# EasyEDA Pro project ProPrj_New Project_2025-07-06_18-28-47_2025-07-14.epro

# Board PCB1
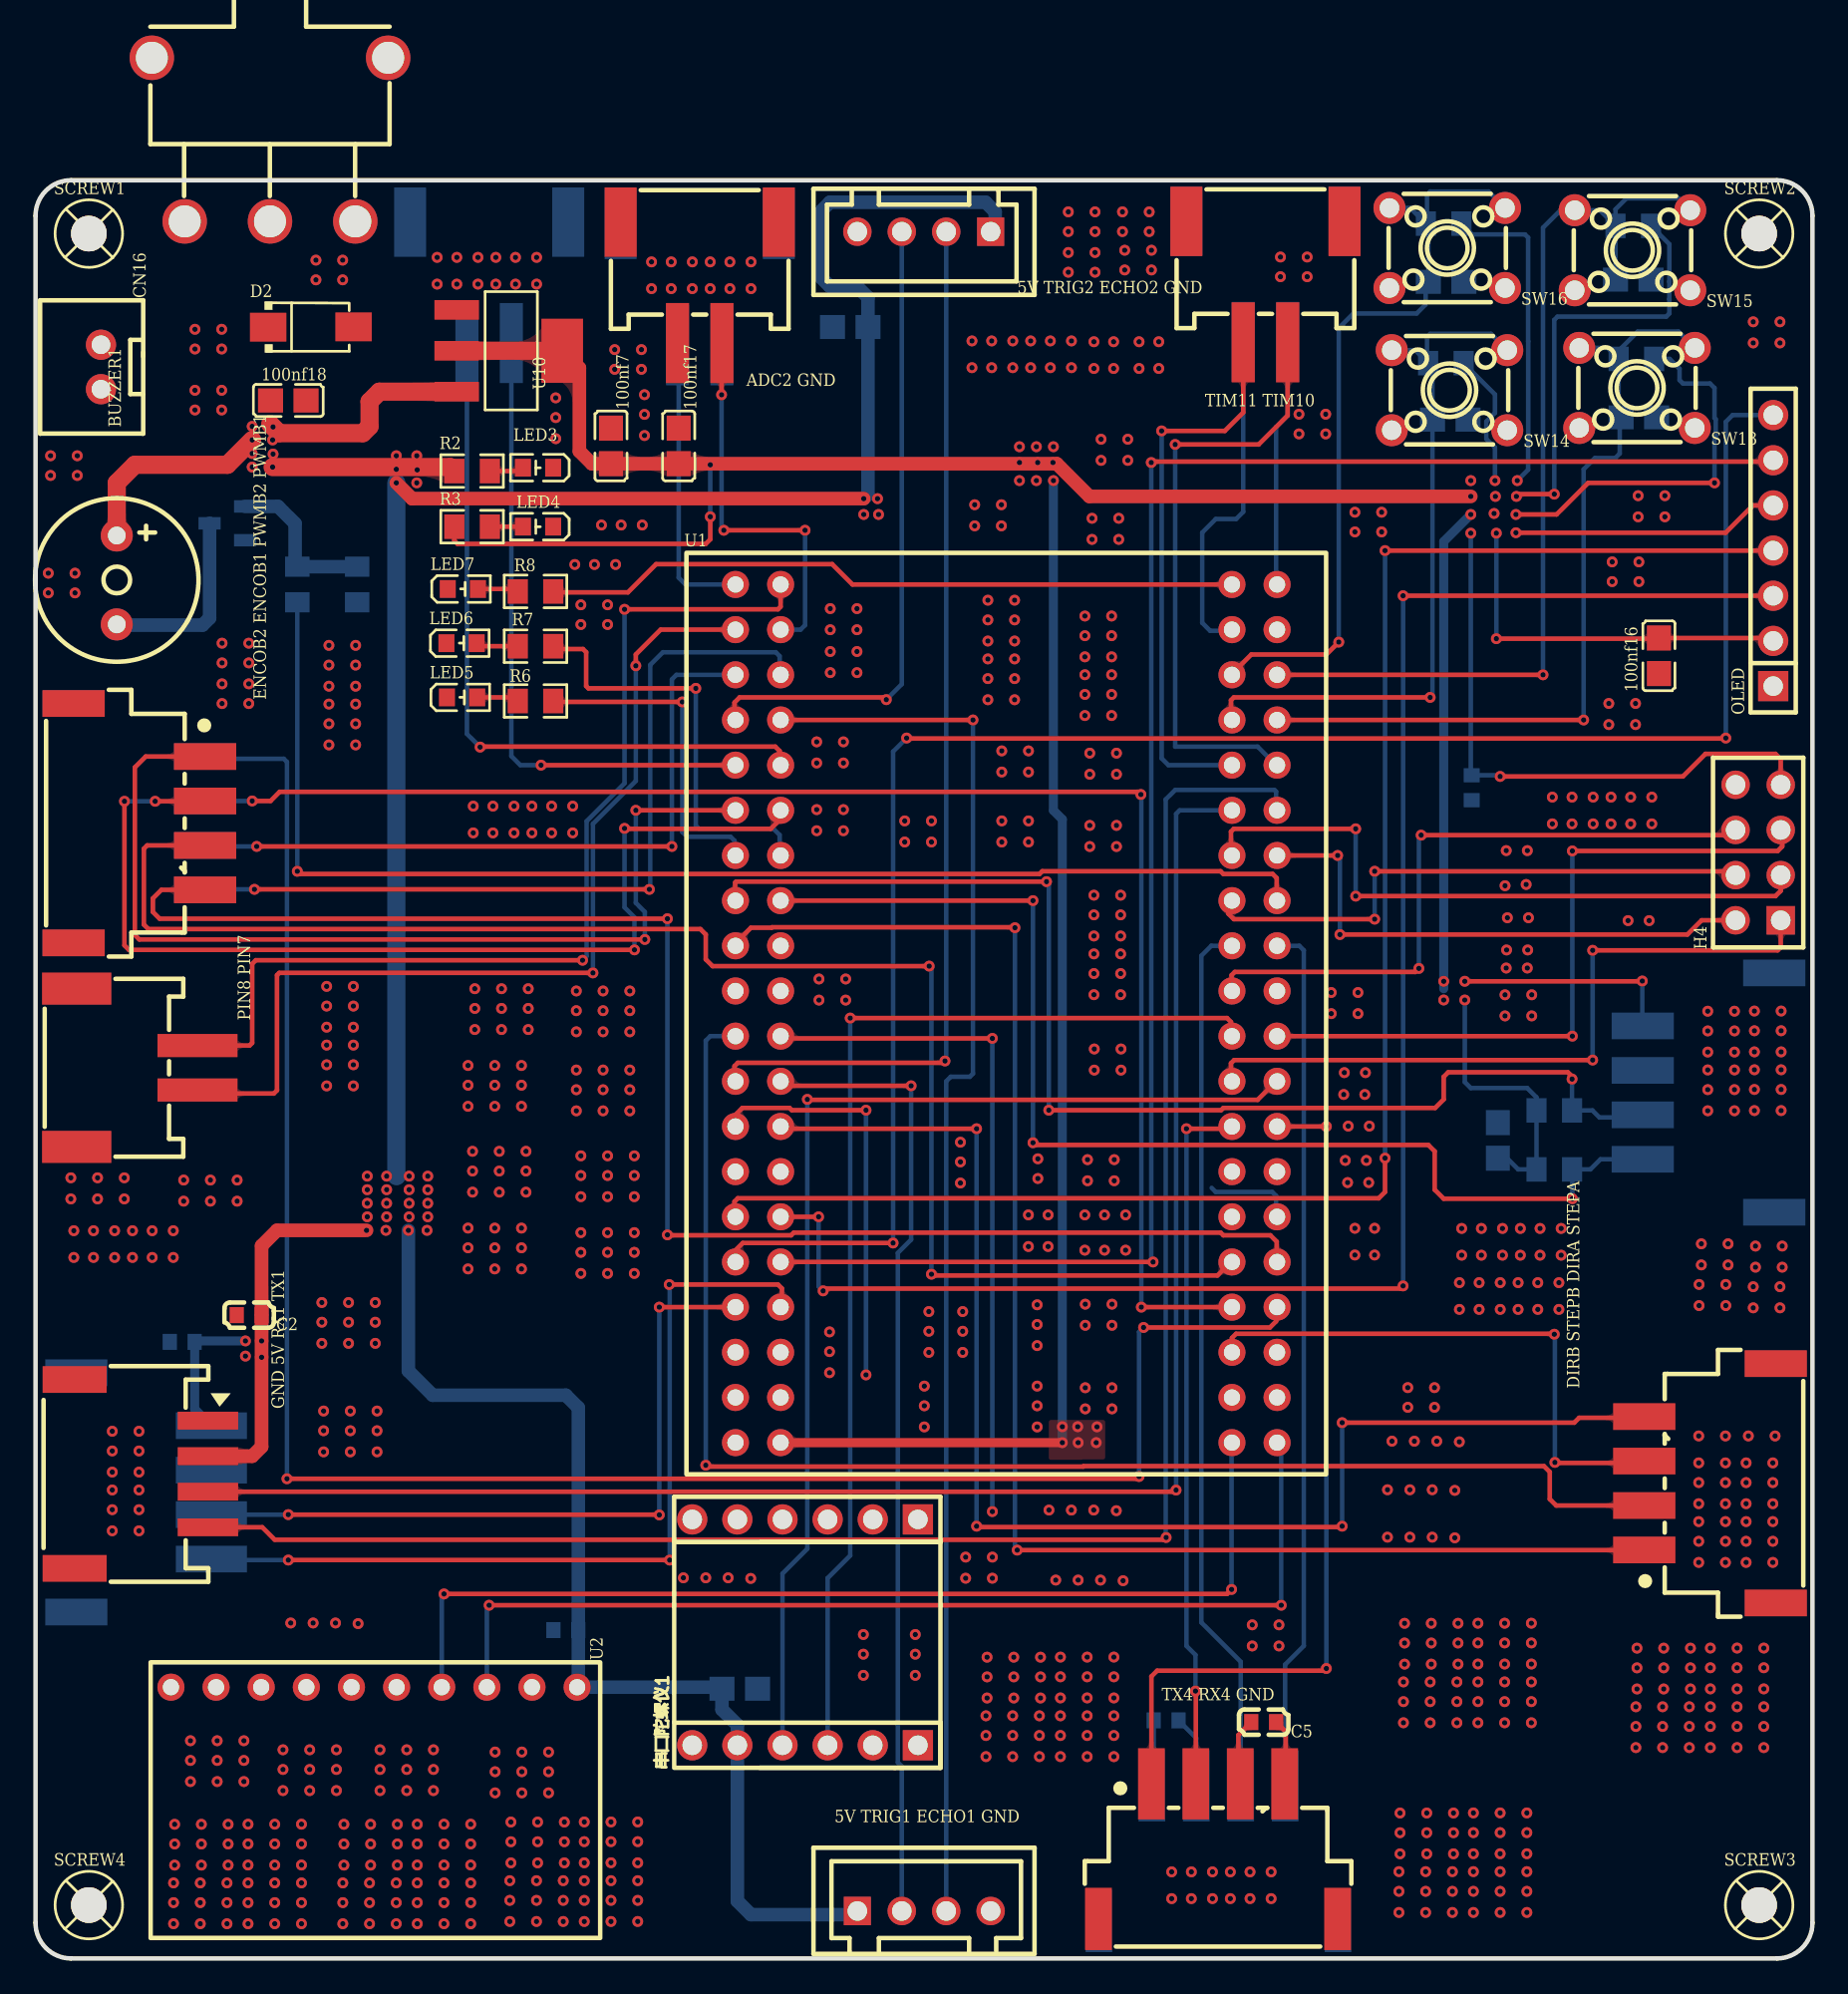
[diagram p0: board, top side]
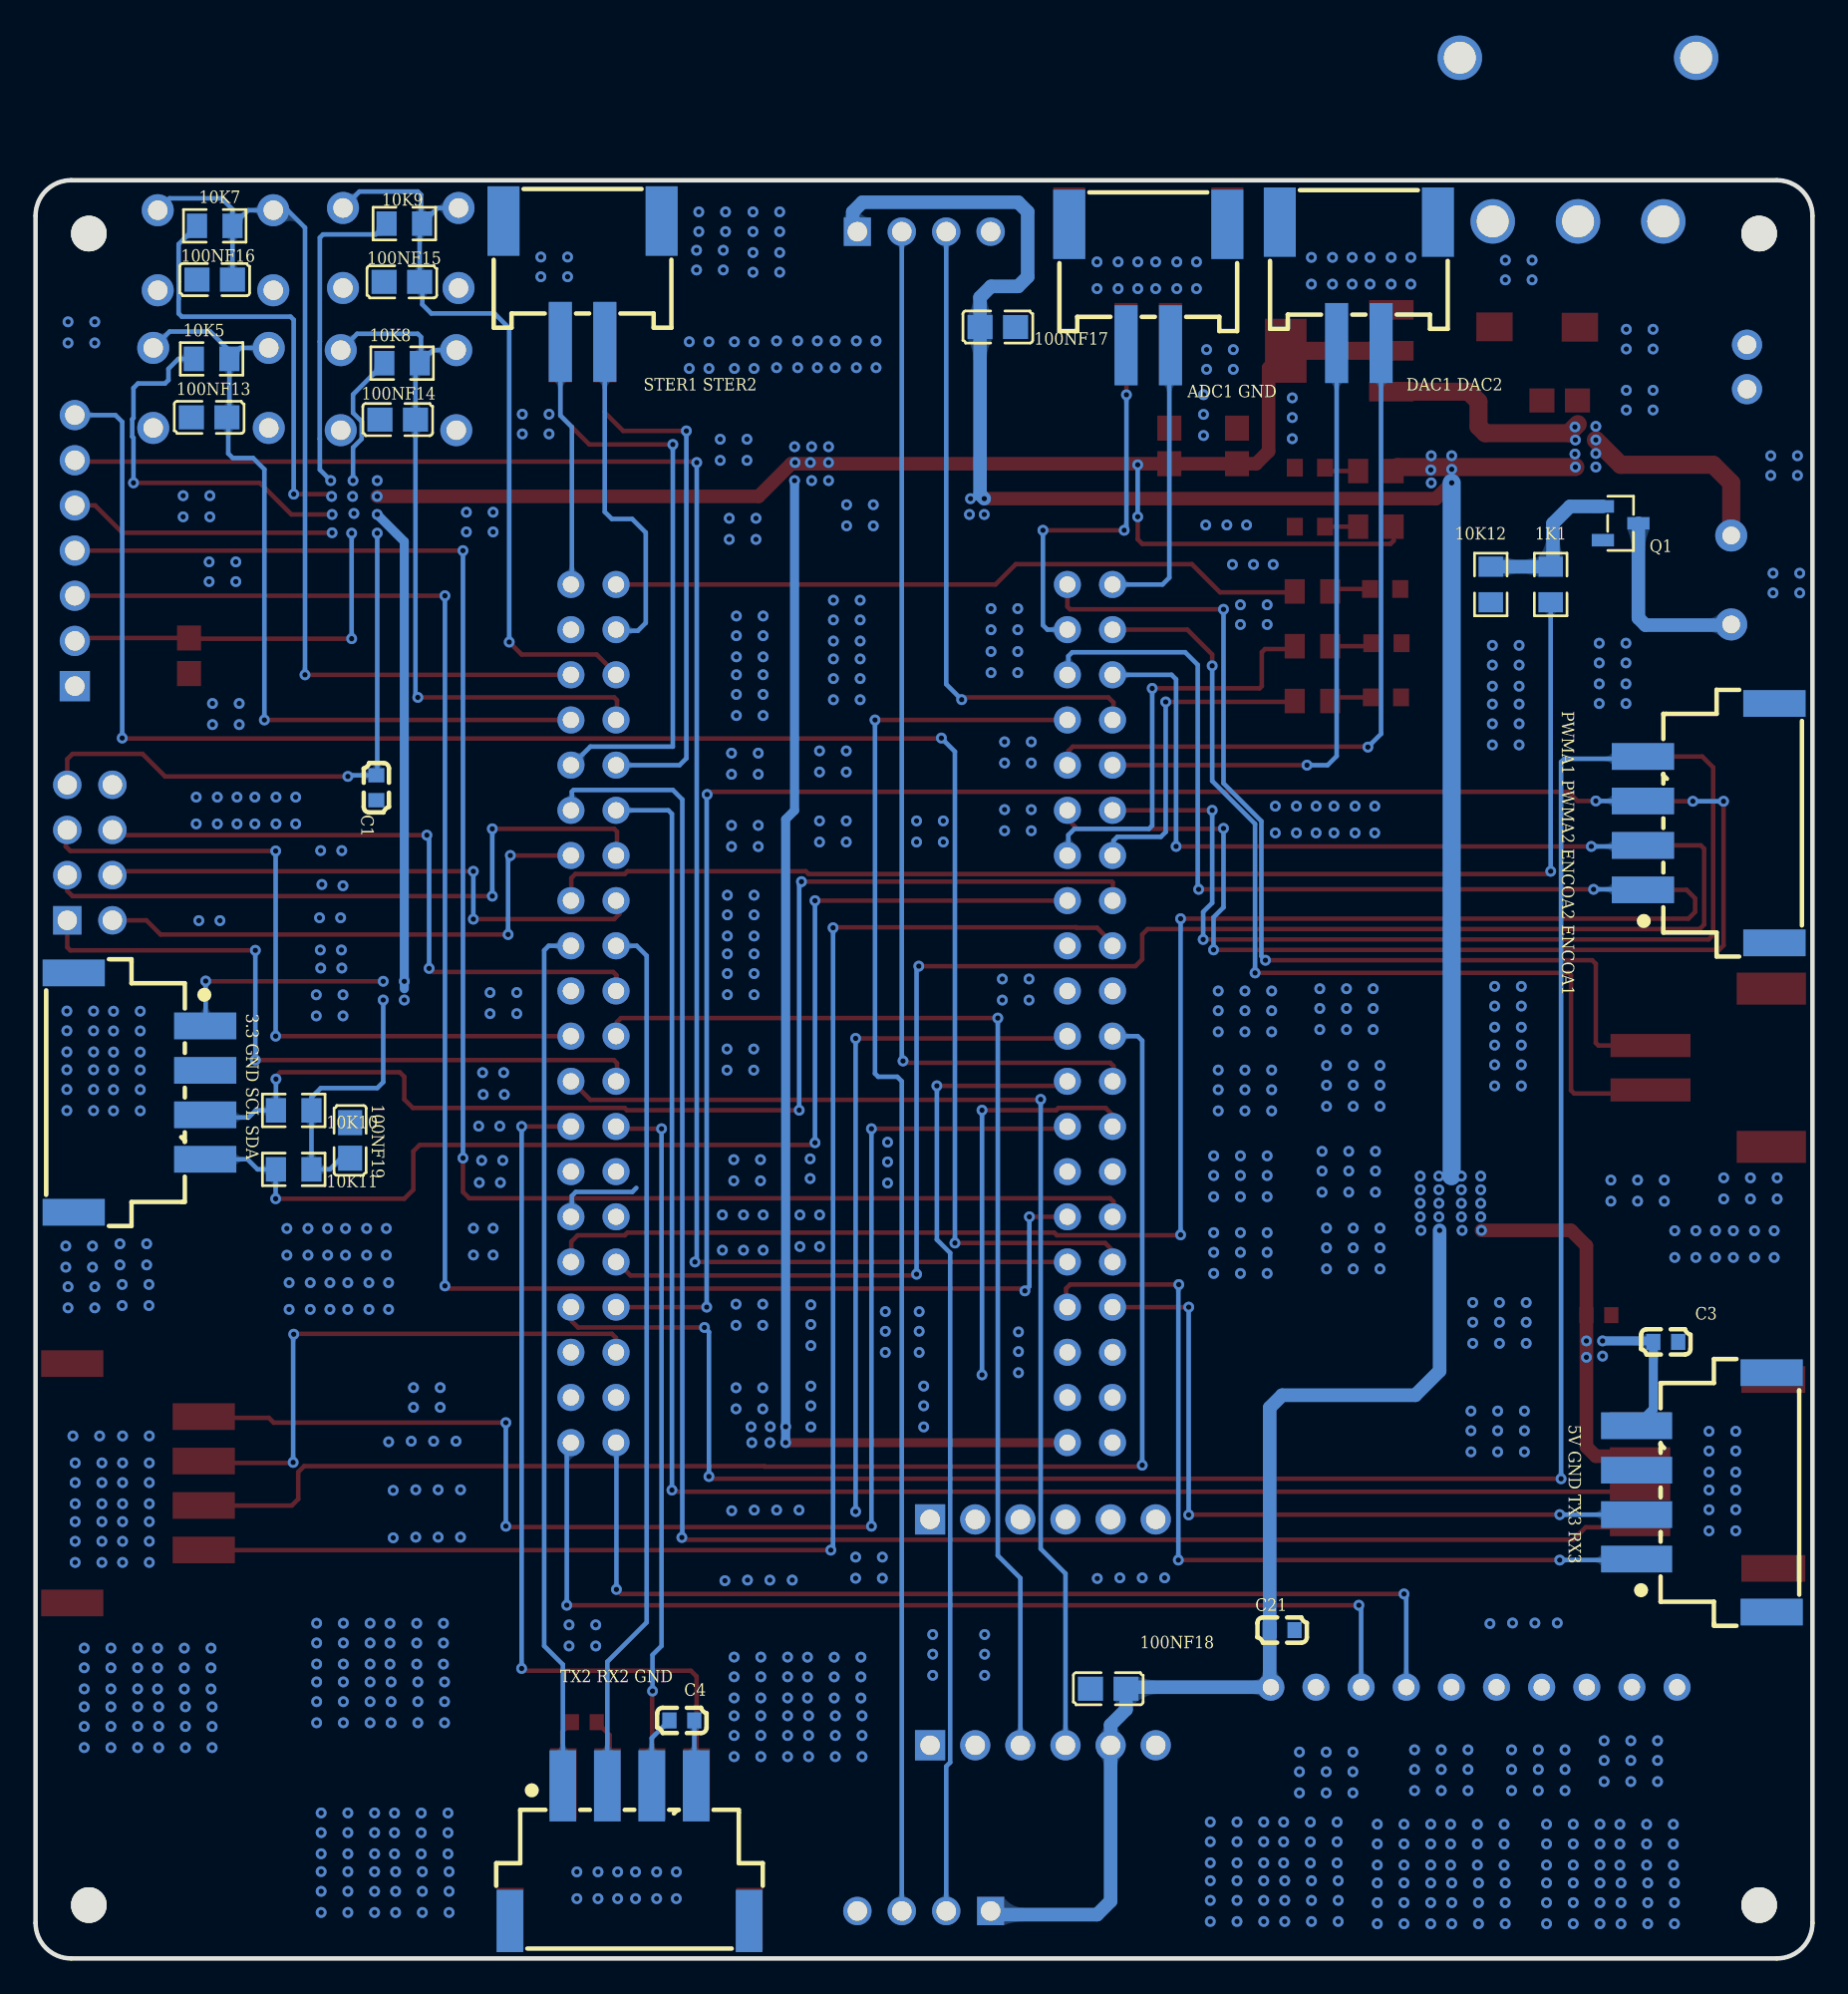
[diagram p1: board, bottom side, seen from below]

Outline 100 x 100 mm; copper layers: Top Layer, Bottom Layer. Coordinates in mm from the lower left corner of the outline.
Outline path: 0,98 0,2 arc(0.59,0.59) 2,0 98,0 arc(99.41,0.59) 100,2 100,98 arc(99.41,99.41) 98,100 2,100 arc(0.59,99.41) 0,98
Stack: Top Layer 0.035mm / Dielectric1 1.51mm FR4 er 4.5 / Bottom Layer 0.035mm

## Design rules (mm)
template: JLCPCB Capability(Two Layers Board)
spacing copperThickness1oz (default): track to track 0.102, other pairs 0.152 to 0.3
spacing copperThickness2oz: track to track 0.203, other pairs 0.152 to 0.3
track width copperThickness1oz (default): min 0.127, default 0.254, max 2.54
track width copperThickness2oz: min 0.203, default 0.254, max 2.54
differential pair differentialPair (default): width min 0.127, default 0.254, max 2.54; gap min 0.152, default 0.152
via viaSize (default): diameter min 0.5, default 0.61, max 10; hole min 0.3, default 0.305, max 6.3

## Placement (name value [footprint] x y rotation side)
1K1  1k  [R0805]  14.73 77.27 90 bottom
3.3 GND SCL SDA  WAFER-254W-4A  [CONN-SMD_4P-P2.50-WAFER-254W-4P#2]  94.15 48.69 270 bottom
5V GND TX3 RX3  ZX-XH2.54-4PWT  [CONN-SMD_4P-P2.50-WAFER-254W-4P]  6.1 26.21 90 bottom
5V TRIG1 ECHO1 GND  ZX-XH2.54-4PZZ  [CONN-TH_4P-P2.50_4PIN]  50 2.67 0 top
5V TRIG2 ECHO2 GND  ZX-XH2.54-4PZZ  [CONN-TH_4P-P2.50_4PIN]  50 97.11 180 top
10K5  10K  [R0805]  90.09 89.95 180 bottom
10K7  10K  [R0805]  89.92 97.43 180 bottom
10K8  10K  [R0805]  79.37 89.71 180 bottom
10K9  10K  [R0805]  79.24 97.56 180 bottom
10K10  10K  [R0805]  85.47 47.69 0 bottom
10K11  10K  [R0805]  85.47 44.37 0 bottom
10K12  10K  [R0805]  18.1 77.27 270 bottom
100nf7  100nF  [C0805]  32.38 85.06 270 top
100NF13  100nF  [C0805]  90.23 86.67 0 bottom
100NF14  100nF  [C0805]  79.62 86.54 0 bottom
100NF15  100nF  [C0805]  79.38 94.28 0 bottom
100nf16  100nF  [C0805]  91.36 73.26 90 top
100NF16  100nF  [C0805]  89.92 94.41 0 bottom
100nf17  100nF  [C0805]  36.19 85.06 270 top
100NF17  100nF  [C0805]  45.85 91.75 0 bottom
100nf18  100nF  [C0805]  14.22 87.61 180 top
100NF18  100nF  [C0805]  39.63 15.17 180 bottom
100NF19  100nF  [C0805]  82.3 46 270 bottom
 TIM11 TIM10  HCZZ0021-2  [CONN-SMD_2P-P2.50-A2501-WF-02A]  69.22 94.28 0 top
ADC1 GND  HCZZ0021-2  [CONN-SMD_2P-P2.50-A2501-WF-02A]  37.38 94.12 180 bottom
ADC2 GND  HCZZ0021-2  [CONN-SMD_2P-P2.50-A2501-WF-02A]  37.38 94.24 0 top
BUZZER1  3kHz  [BUZ-TH_BD9.0-P5.00-D0.6-FD]  4.57 77.52 270 top
C1  100nF  [C0603]  80.82 65.84 90 bottom
C2  100nF  [C0603]  12.02 36.18 180 top
C3  100nF  [C0603]  8.25 34.67 180 bottom
C4  100nF  [C0603]  63.63 13.39 0 bottom
C5  100nF  [C0603]  69.12 13.29 180 top
C21  100nF  [C0603]  29.84 18.47 180 bottom
CN16  HX25037-2A  [CONN-TH_2P-P2.50-XH2.54-2P]  3.68 89.5 270 top
D2  SS54  [SMA_L4.3-W2.6-LS5.0-RD]  15.49 91.75 0 top
DAC1 DAC2  HCZZ0021-2  [CONN-SMD_2P-P2.50-A2501-WF-02A]  25.53 94.24 180 bottom
DIRB STEPB DIRA STEPA  WAFER-254W-4A  [CONN-SMD_4P-P2.50-WAFER-254W-4P#2]  94.23 26.72 90 top
ENCOB2 ENCOB1 PWMB2 PWMB1  WAFER-254W-4A  [CONN-SMD_4P-P2.50-WAFER-254W-4P#2]  5.84 63.84 270 top
GND 5V RX1 TX1  MXPH-2.0-04P-WG1-0-A  [CONN-SMD_4P-P2.00_MXPH-2.0-4P-WG1-0-A]  5.95 27.25 270 top
H4  DS1023-2*4SF11  [HDR-TH_8P-P2.54-V-F-R2-C4-S2.54]  96.94 62.19 90 top
LED3  NCD0603G1  [LED0603-RD_1]  28.28 83.83 180 top
LED4  NCD0603G1  [LED0603-RD_1]  28.28 80.52 180 top
LED5  NCD0603G1  [LED0603-RD_1]  24 70.92 0 top
LED6  NCD0603G1  [LED0603-RD_1]  23.97 73.97 0 top
LED7  NCD0603G1  [LED0603-RD_1]  24.05 77.01 0 top
OLED  -  [HDR-TH_7P-P2.54-V-M]  97.79 79.17 90 top
PIN8 PIN7  HCZZ0021-2  [CONN-SMD_2P-P2.50-A2501-WF-02A]  5.72 50.09 90 top
PWMA1 PWMA2 ENCOA2 ENCOA1  WAFER-254W-4A  [CONN-SMD_4P-P2.50-WAFER-254W-4P#2]  5.84 63.84 90 bottom
Q1  SS8050  [SOT-23-3_L2.9-W1.3-P1.90-LS2.4-BR]  10.8 80.71 0 bottom
R2  5kΩ  [R0805]  24.57 83.65 0 top
R3  2kΩ  [R0805]  24.57 80.52 0 top
R6  2kΩ  [R0805]  28.14 70.72 180 top
R7  2kΩ  [R0805]  28.14 73.8 180 top
R8  2kΩ  [R0805]  28.14 76.88 180 top
SCREW1  -  [M2螺丝]  3 97 0 top
SCREW2  -  [M2螺丝]  97 97 0 top
SCREW3  -  [M2螺丝]  97 3 0 top
SCREW4  -  [M2螺丝]  3 3 0 top
STER1 STER2   -  [CONN-SMD_2P-P2.50-A2501-WF-02A]  69.22 94.31 180 bottom
SW13  K2-1102DP-C4SW-04  [KEY-TH_4P-L6.0-W6.0-P4.50-LS6.5]  90.13 88.32 180 top
SW14  K2-1102DP-C4SW-04  [KEY-TH_4P-L6.0-W6.0-P4.50-LS6.5]  79.57 88.19 180 top
SW15  K2-1102DP-C4SW-04  [KEY-TH_4P-L6.0-W6.0-P4.50-LS6.5]  89.87 96.06 180 top
SW16  K2-1102DP-C4SW-04  [KEY-TH_4P-L6.0-W6.0-P4.50-LS6.5]  79.45 96.19 180 top
SW17  SS-12D11L5  [SW-TH_SS-12D11L5]  13.19 102.29 0 top
TX2 RX2 GND  ZX-XH2.54-4PWT  [CONN-SMD_4P-P2.50-WAFER-254W-4P]  66.57 5.91 180 bottom
TX4 RX4 GND  ZX-XH2.54-4PWT  [CONN-SMD_4P-P2.50-WAFER-254W-4P]  66.55 6.02 0 top
U1  -  [stm32f4最小]  36.63 79.05 0 top
U2  -  [ICM20948V2]  6.48 16.65 270 top
U10  AMS1117-3.3  [SOT-223-3_L6.5-W3.4-P2.30-LS7.0-BR]  26.67 90.41 180 top
串口陀螺仪1  -  [串口陀螺仪]  45.59 17.32 90 top

## Footprints (pads in the part's own frame, mm; a bottom-side part is the same pattern mirrored in y, then rotated)
BUZ-TH_BD9.0-P5.00-D0.6-FD
  round 1.8 hole 1: 1(-2.5,0) 2(2.5,0)
C0603
  rect 0.8x0.9 smd: 1(-0.7,0) 2(0.7,0)
C0805
  rect 1.41x1.35 smd: 1(-1,0) 2(1,0)
CONN-SMD_2P-P2.50-A2501-WF-02A
  rect 1.3x4.5 smd: 1(-1.25,-3.4) 2(1.25,-3.4)
  rect 1.8x3.9 smd: 3(-4.45,3.4) 4(4.45,3.4)
CONN-SMD_4P-P2.00_MXPH-2.0-4P-WG1-0-A
  rect 1x3.4 smd: 1(-3,3.75) 2(-1,3.75) 3(1,3.75) 4(3,3.75)
  rect 1.5x3.6 smd: 5(5.31,-3.75) 6(-5.31,-3.75)
CONN-SMD_4P-P2.50-WAFER-254W-4P
  rect 1.5x4 smd: 1(-3.75,3.8) 2(-1.25,3.8) 3(1.25,3.8) 4(3.75,3.8)
  rect 1.5x3.5 smd: 5(-6.73,-3.8) 6(6.73,-3.8)
CONN-SMD_4P-P2.50-WAFER-254W-4P#2
  rect 1.5x3.5 smd: 1(-3.75,3.7) 2(-1.25,3.7) 3(1.25,3.7) 4(3.75,3.7) 5(-6.73,-3.7) 6(6.73,-3.7)
CONN-TH_2P-P2.50-XH2.54-2P
  round 1.7 hole 1.05: 1(1.25,0) 2(-1.25,0)
CONN-TH_4P-P2.50_4PIN
  rect 1.524x1.6 hole 1.1: 1(-3.75,0)
  round 1.6 hole 1.1: 2(-1.25,0) 3(1.25,0) 4(3.75,0)
HDR-TH_7P-P2.54-V-M
  rect 1.7x1.7 hole 1.1: 1(-7.62,0)
  round 1.7 hole 1.1: 2(-5.08,0) 3(-2.54,0) 4(0,0) 5(2.54,0) 6(5.08,0) 7(7.62,0)
HDR-TH_8P-P2.54-V-F-R2-C4-S2.54
  rect 1.6x1.6 hole 1.1: 1(-3.81,-1.27)
  round 1.6 hole 1.1: 2(-3.81,1.27) 3(-1.27,-1.27) 4(-1.27,1.27) 5(1.27,-1.27) 6(1.27,1.27) 7(3.81,-1.27) 8(3.81,1.27)
ICM20948V2
  round 1.524 hole 0.914: 1(1.397,24.003) 2(1.397,21.463) 3(1.397,18.923) 4(1.397,16.383) 5(1.397,13.843) 6(1.397,11.303) 7(1.397,8.763) 8(1.397,6.223) 9(1.397,3.683) 10(1.397,1.143)
KEY-TH_4P-L6.0-W6.0-P4.50-LS6.5
  round 1.8 hole 1.1: 1(-3.251,-2.251) 2(3.251,-2.251) 3(3.251,2.251) 4(-3.251,2.251)
LED0603-RD_1
  rect 0.9x1 smd: 1(-0.85,0) 2(0.85,0)
M2螺丝
  round 2 hole 2: 1(0,0)
R0805
  rect 1.133x1.377 smd: 1(-1,0) 2(1,0)
SMA_L4.3-W2.6-LS5.0-RD
  rect 2.047x1.621 smd: 1(-2.403,-0.01) 2(2.403,0.01)
SOT-23-3_L2.9-W1.3-P1.90-LS2.4-BR
  rect 1.25x0.7 smd: 1(1,-0.95) 2(1,0.95) 3(-1,0)
SOT-223-3_L6.5-W3.4-P2.30-LS7.0-BR
  rect 2.5x1.1 smd: 1(2.97,-2.3) 2(2.97,0) 3(2.97,2.3)
  rect 2.34x3.6 smd: 4(-2.97,0)
stm32f4最小
  round 1.524 hole 0.914: 1(2.76,-1.778) 2(2.76,-4.318) 3(2.76,-6.858) 4(2.76,-9.398) 5(2.76,-11.938) 6(2.76,-14.478) 7(2.76,-17.018) 8(2.76,-19.558) 9(2.76,-22.098) 10(2.76,-24.638) 11(2.76,-27.178) 12(2.76,-29.718) 13(2.76,-32.258) 14(2.76,-34.798) 15(2.76,-37.338) 16(2.76,-39.878) 17(2.76,-42.418) 18(2.76,-44.958) 19(2.76,-47.498) 20(2.76,-50.038) 21(5.3,-1.778) 22(5.3,-4.318) 23(5.3,-6.858) 24(5.3,-9.398) 25(5.3,-11.938) 26(5.3,-14.478) 27(5.3,-17.018) 28(5.3,-19.558) 29(5.3,-22.098) 30(5.3,-24.638) 31(5.3,-27.178) 32(5.3,-29.718) 33(5.3,-32.258) 34(5.3,-34.798) 35(5.3,-37.338) 36(5.3,-39.878) 37(5.3,-42.418) 38(5.3,-44.958) 39(5.3,-47.498) 40(5.3,-50.038) 41(30.7,-1.778) 42(30.7,-4.318) 43(30.7,-6.858) 44(30.7,-9.398) 45(30.7,-11.938) 46(30.7,-14.478) 47(30.7,-17.018) 48(30.7,-19.558) 49(30.7,-22.098) 50(30.7,-24.638) 51(30.7,-27.178) 52(30.7,-29.718) 53(30.7,-32.258) 54(30.7,-34.798) 55(30.7,-37.338) 56(30.7,-39.878) 57(30.7,-42.418) 58(30.7,-44.958) 59(30.7,-47.498) 60(30.7,-50.038) 61(33.24,-1.778) 62(33.24,-4.318) 63(33.24,-6.858) 64(33.24,-9.398) 65(33.24,-11.938) 66(33.24,-14.478) 67(33.24,-17.018) 68(33.24,-19.558) 69(33.24,-22.098) 70(33.24,-24.638) 71(33.24,-27.178) 72(33.24,-29.718) 73(33.24,-32.258) 74(33.24,-34.798) 75(33.24,-37.338) 76(33.24,-39.878) 77(33.24,-42.418) 78(33.24,-44.958) 79(33.24,-47.498) 80(33.24,-50.038)
SW-TH_SS-12D11L5
  round 2.5 hole 1.8: 1(-4.8,-4.6) 2(0,-4.6) 3(4.8,-4.6) 4(-6.65,4.6) 5(6.65,4.6)
串口陀螺仪
  round 1.7 hole 1.1: 1(-5.334,8.636) 2(-5.334,6.096) 3(-5.334,3.556) 4(-5.334,1.016) 5(-5.334,-1.524) 8(7.366,-1.524) 9(7.366,1.016) 10(7.366,3.556) 11(7.366,6.096) 12(7.366,8.636)
  rect 1.7x1.7 hole 1.1: 6(-5.334,-4.064) 7(7.366,-4.064)

## Nets
+3.3V: 3.3 GND SCL SDA.1 10K5.1 10K7.1 10K8.1 10K9.1 10K10.1 10K11.1 100nf7.2 100nf16.2 100nf17.2 100NF19.2 C1.2 H4.7 OLED.2 OLED.5 R3.1 U1.40 U10.2 U10.4
+5V: 5V GND TX3 RX3.4 5V TRIG1 ECHO1 GND.1 5V TRIG2 ECHO2 GND.1 100NF17.2 100nf18.2 100NF18.2 BUZZER1.1 C2.1 C3.1 C21.1 D2.1 GND 5V RX1 TX1.2 R2.1 SW17.2 SW17.3 U2.1 U10.3 串口陀螺仪1.2
GND: 3.3 GND SCL SDA.2 5V GND TX3 RX3.3 5V TRIG1 ECHO1 GND.4 5V TRIG2 ECHO2 GND.4 10K12.2 100nf7.1 100NF13.2 100NF14.2 100NF15.2 100nf16.1 100NF16.2 100nf17.1 100NF17.1 100nf18.1 100NF18.1 100NF19.1 ADC1 GND.1 ADC2 GND.1 C1.1 C2.2 C3.2 C4.2 C5.2 C21.2 CN16.1 D2.2 GND 5V RX1 TX1.1 H4.8 LED3.1 LED4.1 LED5.1 LED6.1 LED7.1 OLED.1 Q1.2 SW13.3 SW13.4 SW14.3 SW14.4 SW15.3 SW15.4 SW16.3 SW16.4 TX2 RX2 GND.3 TX4 RX4 GND.3 U1.20 U2.2 U10.1 串口陀螺仪1.5
ADC1: ADC1 GND.2 U1.1
ADC2: ADC2 GND.2 U1.22
AIN1/DIRA: U1.30
AIN2/ENA: U1.10
BEEP: 1K1.1 U1.68
BIN1/DIRB: U1.75
BIN2/ENB: U1.54
CE: H4.6 U1.50
CIN1/DIRC: U1.14
CIN2/ENC: U1.34
CLKR: H4.4 U1.48
CSR: H4.5 U1.71
DAC1: DAC1 DAC2.2 U1.25
DAC2: DAC1 DAC2.1 U1.5
DIN1/DIRD: U1.18
DIN2/END: U1.38
DIRA: DIRB STEPB DIRA STEPA.2 U1.11
DIRB: DIRB STEPB DIRA STEPA.4 U1.33
ECHO1: 5V TRIG1 ECHO1 GND.3 U1.24
ECHO2: 5V TRIG2 ECHO2 GND.3 U1.4
ENA: U1.31
ENB: U1.13
ENCOA1: PWMA1 PWMA2 ENCOA2 ENCOA1.1 U1.23
ENCOA2: PWMA1 PWMA2 ENCOA2 ENCOA1.2 U1.3
ENCOB1: ENCOB2 ENCOB1 PWMB2 PWMB1.2 U1.26
ENCOB2: ENCOB2 ENCOB1 PWMB2 PWMB1.1 U1.6
ENCOC1: U1.19
ENCOC2: U1.39
ENCOD1: U1.79
ENCOD2: U1.59
FREE_TIME10:  TIM11 TIM10.2 U1.65
FREE_TIME11:  TIM11 TIM10.1 U1.45
IRQ: H4.1 U1.52
KEY1: 10K5.2 100NF13.1 SW13.1 SW13.2 U1.64
KEY2: 10K8.2 100NF14.1 SW14.1 SW14.2 U1.44
KEY3: 10K7.2 100NF16.1 SW15.1 SW15.2 U1.63
KEY4: 10K9.2 100NF15.1 SW16.1 SW16.2 U1.43
LED1: R8.1 U1.41
LED2: R7.1 U1.27
LED3: R6.1 U1.7
MISOR: H4.2 U1.67
MOSIR: H4.3 U1.47
OLEDCLK: OLED.3 U1.35
OLEDCS: OLED.7 U1.16
OLEDDC: OLED.6 U1.36
OLEDMOSI: OLED.4 U1.15
PIN7: PIN8 PIN7.1 U1.2
PIN8: PIN8 PIN7.2 U1.21
PWMA1: PWMA1 PWMA2 ENCOA2 ENCOA1.4 U1.77
PWMA2: PWMA1 PWMA2 ENCOA2 ENCOA1.3 U1.57
PWMB1: ENCOB2 ENCOB1 PWMB2 PWMB1.4 U1.76
PWMB2: ENCOB2 ENCOB1 PWMB2 PWMB1.3 U1.56
RSET: U1.78
SCL: U1.80 U2.3
SCL_FREE: 3.3 GND SCL SDA.3 10K10.2 U1.8
SDA: U1.60 U2.4
SDA_FREE: 3.3 GND SCL SDA.4 10K11.2 U1.28
STEER1: STER1 STER2 .2 U1.42
STEER2: STER1 STER2 .1 U1.61
STEPA: DIRB STEPB DIRA STEPA.1 U1.9
STEPB: DIRB STEPB DIRA STEPA.3 U1.58
SWCLK: U1.74
SWDIO: U1.55
TRIG1: 5V TRIG1 ECHO1 GND.2 U1.32
TRIG2: 5V TRIG2 ECHO2 GND.2 U1.12
USART1RX: GND 5V RX1 TX1.3 U1.46
USART1TX: GND 5V RX1 TX1.4 U1.66
USART2RX: TX2 RX2 GND.2 U1.49
USART2TX: TX2 RX2 GND.1 U1.69
USART3RX: 5V GND TX3 RX3.1 U1.37
USART3TX: 5V GND TX3 RX3.2 U1.17
USART4RX: TX4 RX4 GND.2 U1.53
USART4TX: TX4 RX4 GND.1 U1.73
WT1RX: U1.51 串口陀螺仪1.4
WT1TX: U1.72 串口陀螺仪1.3
$1N1394: C4.1 TX2 RX2 GND.4
$1N1400: C5.1 TX4 RX4 GND.4
$1N3379: 1K1.2 10K12.1 Q1.1
$1N3380: BUZZER1.2 Q1.3
$1N4295: LED3.2 R2.2
$1N4297: LED4.2 R3.2
$1N4301: LED5.2 R6.2
$1N4304: LED6.2 R7.2
$1N4307: LED7.2 R8.2
$1N5704: CN16.2 SW17.1

Pads without a net: 3.3 GND SCL SDA 5 6; 5V GND TX3 RX3 5 6;  TIM11 TIM10 3 4; ADC1 GND 3 4; ADC2 GND 3 4; DAC1 DAC2 3 4; DIRB STEPB DIRA STEPA 5 6; ENCOB2 ENCOB1 PWMB2 PWMB1 5 6; GND 5V RX1 TX1 5 6; PIN8 PIN7 3 4; PWMA1 PWMA2 ENCOA2 ENCOA1 5 6; SCREW1 1; SCREW2 1; SCREW3 1; SCREW4 1; STER1 STER2  3 4; SW17 4 5; TX2 RX2 GND 5 6; TX4 RX4 GND 5 6; U1 29 62 70; U2 5 6 7 8 9 10; 串口陀螺仪1 1 6 7 8 9 10 11 12

## Via types
v1: diameter 0.61, hole 0.305, Top Layer to Bottom Layer, 1101 vias

## Routing (per net, layer and track width the routed paths; a pad name or vN(x,y) marks a point on that pad's centre or on a via; arc(x,y) is an arc through that point)
+3.3V: length 349.3
  Top Layer w0.254: v1(37.97,81.08) 37.97,79.81 37.72,79.55 23.75,79.55 23.57,79.73 R3.1 ; H4.7 98.21,67.44 97.92,67.74 93.98,67.74 92.71,66.47 v1(82.42,66.47) ; v1(83.31,80.18) 95.11,80.18 96.65,81.71 OLED.5 ; v1(85.47,82.35) 83.47,82.35 v1(83.34,82.22) ; 90.3,54.92 90.26,54.95 v1(80.43,54.95) ; v1(82.21,74.22) 91.32,74.22 100nf16.2 97.62,74.26 OLED.2 ; v1(83.31,81.2) 85.6,81.2 87.38,82.98 v1(94.49,82.98)
  Top Layer w0.508: v1(57.78,29.01) 41.88,29.01
  Top Layer w0.762: v1(80.77,82.22) 59.31,82.22 57.47,84.06 100nf17.2 100nf7.2 31.31,84.06 30.61,84.76 30.61,89.44 U10.4
  Top Layer w1.016: U10.2 U10.4
  Bottom Layer w0.254: v1(37.97,81.08) v1(37.97,84) ; 100NF19.2 82.81,45 83.44,44.37 10K11.1 10K10.1 84.47,48.42 83.95,48.95 80.77,48.95 80.43,49.28 v1(80.43,53.9) ; v1(85.47,82.35) 85.47,92.15 85.65,92.33 91.77,92.33 91.95,92.51 91.95,93.32 91.94,93.32 91.94,94.3 91.95,94.3 91.95,96.4 10K7.1 ; C1.2 82.36,66.54 v1(82.42,66.47) ; v1(82.21,80.15) v1(82.21,74.22) ; v1(80.77,80.15) 80.77,66.73 ; 3.3 GND SCL SDA.1 90.42,52.47 v1(90.42,54.97) ; 10K5.1 91.96,89.95 92.52,89.4 92.52,88.76 92.71,88.57 94.23,88.57 94.49,88.32 94.49,86.63 94.56,86.56 94.56,85.58 94.49,85.51 v1(94.49,82.98) ; v1(82.13,83.11) 82.13,84.97 81.65,85.45 81.65,86.43 82.13,86.92 82.13,87.95 10K8.1 ; v1(83.39,83.11) 84,83.72 84,85.45 84,85.45 84,90.93 84,90.94 84,96.77 83.82,96.95 80.85,96.95 10K9.1
  Bottom Layer w0.508: v1(57.78,29.01) v1(57.78,29.9) 57.78,64.06 57.28,64.56 v1(57.28,83.11) ; v1(80.77,81.2) 79.25,79.68 v1(79.25,54.95) 79.25,54.53
  vias: v1(55.37,85.01) v1(55.37,84.12) v1(55.37,83.11) v1(56.32,85.01) v1(56.32,83.11) v1(56.4,84.12) v1(57.28,85.01) v1(57.26,84.12) v1(58.65,29.9) v1(58.67,29.01) v1(59.74,29.9) v1(59.69,29.01) v1(79.25,53.9) v1(80.77,83.11) v1(82.08,81.26) v1(82.16,82.22)
+5V: length 220.3
  Top Layer w0.762: v1(46.61,82.09) 21.19,82.09 v1(20.3,82.98) ; GND 5V RX1 TX1.2 12.19,28.25 12.72,28.78 v1(12.72,33.81) v1(12.72,34.73) C2.1 12.72,40.08 13.59,40.94 v1(18.63,40.94)
  Top Layer w1.016: R2.1 23.34,83.87 v1(13.34,83.87) ; BUZZER1.1 4.57,82.98 5.59,84 10.8,84 v1(12.19,85.39) ; 13.21,86.28 13.72,85.78 18.42,85.78 18.8,86.16 18.8,87.55 19.35,88.11 U10.3
  Bottom Layer w0.508: 9.9,29.96 8.95,30.9 C3.1 9.01,34.73 v1(11.81,34.73)
  Bottom Layer w0.762: 5V TRIG2 ECHO2 GND.1 54.01,97.36 54.01,98.22 53.47,98.76 44.7,98.76 44.16,98.22 44.16,94.57 44.7,94.03 46.23,94.03 46.85,93.41 100NF17.2 46.85,82.33 v1(46.61,82.09) ; v1(20.98,40.94) 20.98,33.04 22.35,31.67 29.84,31.67 30.54,30.97 C21.1 30.54,15.32 U2.1 38.54,15.25 100NF18.2 38.63,14 39.5,13.13 串口陀螺仪1.2 39.5,3.23 40.26,2.46 46.05,2.46 5V TRIG1 ECHO1 GND.1
  Bottom Layer w1.016: 20.32,43.99 20.3,44.01 v1(20.3,82.98)
  vias: v1(11.81,33.87) v1(12.19,86.16) v1(12.19,84.63) v1(12.19,83.87) v1(13.34,85.39) v1(13.37,86.13) v1(13.37,84.6) v1(18.67,43.99) v1(18.67,43.23) v1(18.67,42.47) v1(18.67,41.71) v1(19.72,40.94) v1(19.76,43.99) v1(19.76,43.23) v1(19.76,42.47) v1(19.76,41.71) v1(20.3,84.51) v1(20.3,83.74) v1(21.02,43.99) v1(21.02,43.23) v1(21.02,42.47) v1(21.02,41.71) v1(21.45,84.51) v1(21.48,83.71) v1(21.45,82.98) v1(22.03,40.94) v1(22.07,43.99) v1(22.07,43.23) v1(22.07,42.47) v1(22.07,41.71) v1(46.61,81.2) v1(47.38,82.09) v1(47.44,81.2)
GND: length 7.9
  Top Layer w0.254: TX4 RX4 GND.3 67.69,9.93 67.69,12.56 C5.2
  Bottom Layer w0.254: C4.2 65.32,12.39 TX2 RX2 GND.3
  vias: v1(0.72,77.9) v1(0.72,76.79) v1(0.84,84.51) v1(0.84,83.4) v1(1.99,43.9) v1(1.99,42.71) v1(2.22,77.9) v1(2.22,76.79) v1(2.15,40.92) v1(2.15,39.42) v1(2.35,84.51) v1(2.35,83.4) v1(3.26,40.92) v1(3.26,39.42) v1(3.49,43.9) v1(3.49,42.71) v1(4.32,29.65) v1(4.32,28.54) v1(4.32,27.35) v1(4.32,26.34) v1(4.32,25.24) v1(4.32,24.05) v1(4.45,40.92) v1(4.45,39.42) v1(5,43.9) v1(5,42.71) v1(5.46,40.92) v1(5.46,39.42) v1(5.82,29.65) v1(5.82,28.54) v1(5.82,27.35) v1(5.82,26.34) v1(5.82,25.24) v1(5.82,24.05) v1(6.56,40.92) v1(6.56,39.42) v1(7.75,40.92) v1(7.75,39.42) v1(7.83,7.54) v1(7.83,6.44) v1(7.83,5.25) v1(7.77,4.25) v1(7.77,3.14) v1(7.77,1.95) v1(8.34,43.77) v1(8.34,42.59) v1(8.72,12.24) v1(8.72,11.13) v1(8.72,9.95) v1(8.97,91.62) v1(8.97,90.51) v1(8.97,88.19) v1(8.97,87.08) v1(9.33,7.54) v1(9.33,6.44) v1(9.33,5.25) v1(9.27,4.25) v1(9.27,3.14) v1(9.27,1.95) v1(9.84,43.77) v1(9.84,42.59) v1(10.22,12.24) v1(10.22,11.13) v1(10.22,9.95) v1(10.48,91.62) v1(10.48,90.51) v1(10.48,88.19) v1(10.48,87.08) v1(10.5,73.97) v1(10.5,72.86) v1(10.5,71.68) v1(10.5,70.57) v1(10.84,7.54) v1(10.84,6.44) v1(10.84,5.25) v1(10.78,4.25) v1(10.78,3.14) v1(10.78,1.95) v1(11.34,43.77) v1(11.34,42.59) v1(11.73,12.24) v1(11.73,11.13) v1(11.73,9.95) v1(12,73.97) v1(12,72.86) v1(12,71.68) v1(12,70.57) v1(11.96,7.55) v1(11.96,6.44) v1(11.96,5.25) v1(11.96,4.25) v1(11.96,3.14) v1(11.96,1.95) v1(13.46,7.55) v1(13.46,6.44) v1(13.46,5.25) v1(13.46,4.25) v1(13.46,3.14) v1(13.46,1.95) v1(13.92,11.74) v1(13.92,10.63) v1(13.92,9.44) v1(14.36,18.86) v1(14.97,7.55) v1(14.97,6.44) v1(14.97,5.25) v1(14.97,4.25) v1(14.97,3.14) v1(14.97,1.95) v1(15.43,11.74) v1(15.43,10.63) v1(15.43,9.44) v1(15.62,18.86) v1(15.78,95.51) v1(15.78,94.4) v1(16.11,36.89) v1(16.11,35.78) v1(16.11,34.59) v1(16.21,30.78) v1(16.21,29.68) v1(16.21,28.49) v1(16.38,54.67) v1(16.38,53.56) v1(16.38,52.37) v1(16.38,51.36) v1(16.38,50.26) v1(16.38,49.07) v1(16.51,73.84) v1(16.51,72.73) v1(16.51,71.55) v1(16.51,70.54) v1(16.51,69.43) v1(16.51,68.25) v1(16.88,18.86) v1(16.93,11.74) v1(16.93,10.63) v1(16.93,9.44) v1(17.28,95.51) v1(17.28,94.4) v1(17.29,4.25) v1(17.29,3.14) v1(17.29,1.95) v1(17.35,7.54) v1(17.35,6.44) v1(17.35,5.25) v1(17.61,36.89) v1(17.61,35.78) v1(17.61,34.59) v1(17.72,30.78) v1(17.72,29.68) v1(17.72,28.49) v1(17.89,54.67) v1(17.89,53.56) v1(17.89,52.37) v1(17.89,51.36) v1(17.89,50.26) v1(17.89,49.07) v1(18.01,73.84) v1(18.01,72.73) v1(18.01,71.55) v1(18.01,70.54) v1(18.01,69.43) v1(18.01,68.25) v1(18.15,18.83) v1(18.8,4.25) v1(18.8,3.14) v1(18.8,1.95) v1(18.86,7.54) v1(18.86,6.44) v1(18.86,5.25) v1(19.12,36.89) v1(19.12,35.78) v1(19.12,34.59) v1(19.22,30.78) v1(19.22,29.68) v1(19.22,28.49) v1(19.39,11.74) v1(19.39,10.63) v1(19.39,9.44) v1(20.3,4.25) v1(20.3,3.14) v1(20.3,1.95) v1(20.36,7.54) v1(20.36,6.44) v1(20.36,5.25) v1(20.89,11.74) v1(20.89,10.63) v1(20.89,9.44) v1(21.48,7.55) v1(21.48,6.44) v1(21.48,5.25) v1(21.48,4.25) v1(21.48,3.14) v1(21.48,1.95) v1(22.39,11.74) v1(22.39,10.63) v1(22.39,9.44) v1(22.6,95.66) v1(22.6,94.16) v1(22.99,7.55) v1(22.99,6.44) v1(22.99,5.25) v1(22.99,4.25) v1(22.99,3.14) v1(22.99,1.95) v1(23.71,95.66) v1(23.71,94.16) v1(24.34,50.22) v1(24.34,49.11) v1(24.34,47.92) v1(24.34,41.07) v1(24.34,39.96) v1(24.34,38.78) v1(24.49,7.55) v1(24.49,6.44) v1(24.49,5.25) v1(24.49,4.25) v1(24.49,3.14) v1(24.49,1.95) v1(24.63,64.8) v1(24.63,63.3) v1(24.59,45.39) v1(24.59,44.28) v1(24.59,43.09) v1(24.72,54.53) v1(24.72,53.43) v1(24.72,52.24) v1(24.9,95.66) v1(24.9,94.16) v1(25.74,64.8) v1(25.74,63.3) v1(25.84,50.22) v1(25.84,49.11) v1(25.84,47.92) v1(25.84,41.07) v1(25.84,39.96) v1(25.84,38.78) v1(25.9,95.66) v1(25.9,94.16) v1(25.86,11.61) v1(25.86,10.5) v1(25.86,9.31) v1(26.1,45.39) v1(26.1,44.28) v1(26.1,43.09) v1(26.22,54.53) v1(26.22,53.43) v1(26.22,52.24) v1(26.69,4.37) v1(26.69,3.27) v1(26.69,2.08) v1(26.75,7.67) v1(26.75,6.56) v1(26.75,5.38) v1(26.93,64.8) v1(26.93,63.3) v1(27.01,95.66) v1(27.01,94.16) v1(27.35,50.22) v1(27.35,49.11) v1(27.35,47.92) v1(27.35,41.07) v1(27.35,39.96) v1(27.35,38.78) v1(27.37,11.61) v1(27.37,10.5) v1(27.37,9.31) v1(27.6,45.39) v1(27.6,44.28) v1(27.6,43.09) v1(27.73,54.53) v1(27.73,53.43) v1(27.73,52.24) v1(27.94,64.8) v1(27.94,63.3) v1(28.2,95.66) v1(28.2,94.16) v1(28.19,4.37) v1(28.19,3.27) v1(28.19,2.08) v1(28.26,7.67) v1(28.26,6.56) v1(28.26,5.38) v1(28.87,11.61) v1(28.87,10.5) v1(28.87,9.31) v1(29.04,64.8) v1(29.04,63.3) v1(29.27,87.76) v1(29.27,86.65) v1(29.27,85.47) v1(29.7,4.37) v1(29.7,3.27) v1(29.7,2.08) v1(29.76,7.67) v1(29.76,6.56) v1(29.76,5.38) v1(30.23,64.8) v1(30.23,63.3) v1(30.35,78.39) v1(30.44,54.41) v1(30.44,53.3) v1(30.44,52.11) v1(30.44,49.96) v1(30.44,48.85) v1(30.44,47.67) v1(30.69,76.12) v1(30.69,75.02) v1(30.69,45.14) v1(30.69,44.03) v1(30.69,42.84) v1(30.69,40.82) v1(30.69,39.71) v1(30.69,38.52) v1(30.88,7.68) v1(30.88,6.57) v1(30.88,5.38) v1(30.88,4.37) v1(30.88,3.27) v1(30.88,2.08) v1(31.46,78.39) v1(31.85,80.61) v1(31.94,54.41) v1(31.94,53.3) v1(31.94,52.11) v1(31.94,49.96) v1(31.94,48.85) v1(31.94,47.67) v1(32.19,76.12) v1(32.19,75.02) v1(32.19,45.14) v1(32.19,44.03) v1(32.19,42.84) v1(32.19,40.82) v1(32.19,39.71) v1(32.19,38.52) v1(32.38,7.68) v1(32.38,6.57) v1(32.38,5.38) v1(32.38,4.37) v1(32.38,3.27) v1(32.38,2.08) v1(32.59,90.47) v1(32.59,89.37) v1(32.64,78.39) v1(32.96,80.61) v1(33.44,54.41) v1(33.44,53.3) v1(33.44,52.11) v1(33.44,49.96) v1(33.44,48.85) v1(33.44,47.67) v1(33.7,45.14) v1(33.7,44.03) v1(33.7,42.84) v1(33.7,40.82) v1(33.7,39.71) v1(33.7,38.52) v1(33.89,7.68) v1(33.89,6.57) v1(33.89,5.38) v1(33.89,4.37) v1(33.89,3.27) v1(33.89,2.08) v1(34.1,90.47) v1(34.1,89.37) v1(34.14,80.61) v1(34.27,87.94) v1(34.27,86.83) v1(34.27,85.64) v1(34.67,95.41) v1(34.67,93.9) v1(35.77,95.41) v1(35.77,93.9) v1(36.46,21.4) v1(36.96,95.41) v1(36.96,93.9) v1(37.72,21.4) v1(37.97,95.41) v1(37.97,93.9) v1(38.98,21.4) v1(39.08,95.41) v1(39.08,93.9) v1(40.25,21.37) v1(40.26,95.41) v1(40.26,93.9) v1(43.96,68.42) v1(43.96,67.23) v1(43.96,64.61) v1(43.96,63.42) v1(44.09,55.08) v1(44.09,53.89) v1(44.72,75.91) v1(44.72,74.72) v1(44.72,73.5) v1(44.72,72.31) v1(44.68,35.23) v1(44.68,34.13) v1(44.68,32.94) v1(45.47,68.42) v1(45.47,67.23) v1(45.47,64.61) v1(45.47,63.42) v1(45.59,55.08) v1(45.59,53.89) v1(46.23,75.91) v1(46.23,74.72) v1(46.23,73.5) v1(46.23,72.31) v1(46.59,18.22) v1(46.59,17.11) v1(46.59,15.92) v1(48.91,63.97) v1(48.91,62.78) v1(49.51,18.22) v1(49.51,17.11) v1(49.51,15.92) v1(50.02,32.19) v1(50.02,31.08) v1(50.02,29.89) v1(50.27,36.38) v1(50.27,35.27) v1(50.27,34.08) v1(50.42,63.97) v1(50.42,62.78) v1(52.05,45.9) v1(52.05,44.79) v1(52.05,43.61) v1(52.18,36.38) v1(52.18,35.27) v1(52.18,34.08) v1(52.34,22.57) v1(52.34,21.38) v1(52.7,90.96) v1(52.7,89.46) v1(52.85,81.75) v1(52.85,80.56) v1(53.55,16.94) v1(53.55,15.83) v1(53.55,14.65) v1(53.49,13.65) v1(53.49,12.54) v1(53.49,11.35) v1(53.59,76.38) v1(53.59,75.27) v1(53.59,74.09) v1(53.59,73.08) v1(53.59,71.97) v1(53.59,70.78) v1(53.81,90.96) v1(53.81,89.46) v1(53.85,22.57) v1(53.85,21.38) v1(54.36,81.75) v1(54.36,80.56) v1(54.38,67.91) v1(54.38,66.72) v1(54.38,63.97) v1(54.38,62.78) v1(55,90.96) v1(55,89.46) v1(54.99,13.65) v1(54.99,12.54) v1(54.99,11.35) v1(55.1,76.38) v1(55.1,75.27) v1(55.1,74.09) v1(55.1,73.08) v1(55.1,71.97) v1(55.1,70.78) v1(55.05,16.94) v1(55.05,15.83) v1(55.05,14.65) v1(55.88,67.91) v1(55.88,66.72) v1(55.88,63.97) v1(55.88,62.78) v1(55.88,41.81) v1(55.88,40.04) v1(56,90.96) v1(56,89.46) v1(56.41,44.97) v1(56.41,43.86) v1(56.37,36.76) v1(56.37,35.65) v1(56.37,34.46) v1(56.37,32.19) v1(56.37,31.08) v1(56.37,29.89) v1(56.5,13.65) v1(56.5,12.54) v1(56.5,11.35) v1(56.56,16.94) v1(56.56,15.83) v1(56.56,14.65) v1(56.98,41.81) v1(56.98,40.04) v1(57.03,25.21) v1(57.11,90.96) v1(57.11,89.46) v1(57.41,21.28) v1(57.68,16.95) v1(57.68,15.84) v1(57.68,14.65) v1(57.68,13.65) v1(57.68,12.54) v1(57.68,11.35) v1(58.12,98.22) v1(58.12,97.11) v1(58.12,95.94) v1(58.12,94.83) v1(58.3,90.96) v1(58.3,89.46) v1(58.29,25.21) v1(58.67,21.28) v1(59.06,75.49) v1(59.06,74.39) v1(59.06,73.2) v1(59.06,72.19) v1(59.06,71.08) v1(59.06,69.9) v1(59.05,41.81) v1(59.05,39.83) v1(59.07,36.79) v1(59.07,35.61) v1(59.07,32.09) v1(59.07,30.91) v1(59.2,44.92) v1(59.2,43.73) v1(59.18,16.95) v1(59.18,15.84) v1(59.18,14.65) v1(59.18,13.65) v1(59.18,12.54) v1(59.18,11.35) v1(59.33,67.78) v1(59.33,66.59) v1(59.33,63.72) v1(59.33,62.53) v1(59.46,80.99) v1(59.46,79.8) v1(59.62,98.22) v1(59.62,97.11) v1(59.62,95.94) v1(59.62,94.83) v1(59.56,90.92) v1(59.56,89.41) v1(59.56,59.79) v1(59.56,58.69) v1(59.56,57.5) v1(59.56,56.49) v1(59.56,55.38) v1(59.56,54.2) v1(59.58,51.14) v1(59.58,49.96) v1(59.55,25.21) v1(59.93,21.28) v1(59.96,85.43) v1(59.96,84.25) v1(60.16,41.81) v1(60.16,39.83) v1(60.56,75.49) v1(60.56,74.39) v1(60.56,73.2) v1(60.56,72.19) v1(60.56,71.08) v1(60.56,69.9) v1(60.58,36.79) v1(60.58,35.61) v1(60.58,32.09) v1(60.58,30.91) v1(60.67,90.92) v1(60.67,89.41) v1(60.71,44.92) v1(60.71,43.73) v1(60.69,16.95) v1(60.69,15.84) v1(60.69,14.65) v1(60.69,13.65) v1(60.69,12.54) v1(60.69,11.35) v1(60.83,67.78) v1(60.83,66.59) v1(60.83,63.72) v1(60.83,62.53) v1(60.82,25.18) v1(60.96,80.99) v1(60.96,79.8) v1(61.07,59.79) v1(61.07,58.69) v1(61.07,57.5) v1(61.07,56.49) v1(61.07,55.38) v1(61.07,54.2) v1(61.09,51.14) v1(61.09,49.96) v1(61.17,98.22) v1(61.17,97.11) v1(61.2,21.24) v1(61.3,96.06) v1(61.3,94.95) v1(61.35,41.81) v1(61.35,39.83) v1(61.47,85.43) v1(61.47,84.25) v1(62.1,90.92) v1(62.1,89.41) v1(62.67,98.22) v1(62.67,97.11) v1(62.8,96.06) v1(62.8,94.95) v1(63.21,90.92) v1(63.21,89.41) v1(63.94,4.87) v1(63.94,3.36) v1(65.05,4.87) v1(65.05,3.36) v1(66.23,4.87) v1(66.23,3.36) v1(67.24,4.87) v1(67.24,3.36) v1(68.35,4.87) v1(68.35,3.36) v1(68.47,18.76) v1(68.47,17.57) v1(69.54,4.87) v1(69.54,3.36) v1(69.98,18.76) v1(69.98,17.57) v1(70.06,95.68) v1(70.06,94.57) v1(71.1,86.84) v1(71.1,85.73) v1(71.56,95.68) v1(71.56,94.57) v1(72.61,86.84) v1(72.61,85.73) v1(72.92,54.32) v1(72.92,53.13) v1(73.62,48.58) v1(73.66,49.81) v1(73.71,44.88) v1(73.84,43.63) v1(73.87,46.81) v1(74.25,81.33) v1(74.25,80.22) v1(74.25,41.06) v1(74.25,39.56) v1(74.42,54.32) v1(74.42,53.13) v1(74.84,49.81) v1(74.81,48.58) v1(74.9,44.88) v1(75.03,43.63) v1(75.06,46.81) v1(75.36,41.06) v1(75.36,39.56) v1(75.75,81.33) v1(75.75,80.22) v1(76.08,26.36) v1(76.08,23.69) v1(76.34,29.09) v1(76.73,4.88) v1(76.73,3.77) v1(76.73,2.59) v1(76.79,8.18) v1(76.79,7.07) v1(76.79,5.88) v1(77.04,18.85) v1(77.04,17.74) v1(77.04,16.55) v1(76.98,15.55) v1(76.98,14.44) v1(76.98,13.25) v1(77.23,32.1) v1(77.23,30.99) v1(77.34,26.36) v1(77.34,23.69) v1(77.6,29.09) v1(78.23,4.88) v1(78.23,3.77) v1(78.23,2.59) v1(78.29,8.18) v1(78.29,7.07) v1(78.29,5.88) v1(78.55,18.85) v1(78.55,17.74) v1(78.55,16.55) v1(78.49,15.55) v1(78.49,14.44) v1(78.49,13.25) v1(78.6,26.36) v1(78.6,23.69) v1(78.73,32.1) v1(78.73,30.99) v1(78.86,29.09) v1(79.74,4.88) v1(79.74,3.77) v1(79.74,2.59) v1(79.8,8.18) v1(79.8,7.07) v1(79.8,5.88) v1(79.87,26.32) v1(79.87,23.66) v1(79.99,15.55) v1(79.99,14.44) v1(79.99,13.25) v1(80.13,38) v1(80.13,36.5) v1(80.13,29.05) v1(80.05,18.85) v1(80.05,17.74) v1(80.05,16.55) v1(80.26,41.05) v1(80.26,39.55) v1(80.92,8.18) v1(80.92,7.08) v1(80.92,5.89) v1(80.92,4.88) v1(80.92,3.77) v1(80.92,2.59) v1(81.24,38) v1(81.24,36.5) v1(81.17,18.85) v1(81.17,17.74) v1(81.17,16.56) v1(81.17,15.55) v1(81.17,14.44) v1(81.17,13.25) v1(81.37,41.05) v1(81.37,39.55) v1(82.43,38) v1(82.43,36.5) v1(82.42,8.18) v1(82.42,7.08) v1(82.42,5.89) v1(82.42,4.88) v1(82.42,3.77) v1(82.42,2.59) v1(82.56,41.05) v1(82.56,39.55) v1(82.7,60.33) v1(82.7,54.19) v1(82.7,53) v1(82.68,18.85) v1(82.68,17.74) v1(82.68,16.56) v1(82.68,15.55) v1(82.68,14.44) v1(82.68,13.25) v1(82.77,62.3) v1(82.83,58.52) v1(82.79,56.71) v1(82.76,55.7) v1(83.43,38) v1(83.43,36.5) v1(83.56,41.05) v1(83.56,39.55) v1(83.89,60.4) v1(83.93,8.18) v1(83.93,7.08) v1(83.93,5.89) v1(83.93,4.88) v1(83.93,3.77) v1(83.93,2.59) v1(83.95,62.3) v1(84.02,58.52) v1(83.97,56.71) v1(83.95,55.7) v1(84.2,54.19) v1(84.2,53) v1(84.18,18.85) v1(84.18,17.74) v1(84.18,16.56) v1(84.18,15.55) v1(84.18,14.44) v1(84.18,13.25) v1(84.54,38) v1(84.54,36.5) v1(84.67,41.05) v1(84.67,39.55) v1(85.36,65.31) v1(85.36,63.81) v1(85.73,38) v1(85.73,36.5) v1(85.86,41.05) v1(85.86,39.55) v1(86.47,65.31) v1(86.47,63.81) v1(87.66,65.31) v1(87.66,63.81) v1(88.54,70.58) v1(88.54,69.39) v1(88.73,78.54) v1(88.73,77.43) v1(88.66,65.31) v1(88.66,63.81) v1(89.62,58.36) v1(89.77,65.31) v1(89.77,63.81) v1(90.04,70.58) v1(90.04,69.39) v1(90.12,17.45) v1(90.12,16.34) v1(90.12,15.15) v1(90.06,14.15) v1(90.06,13.04) v1(90.06,11.86) v1(90.19,82.26) v1(90.19,81.07) v1(90.23,78.54) v1(90.23,77.43) v1(90.81,58.36) v1(90.96,65.31) v1(90.96,63.81) v1(91.63,17.45) v1(91.63,16.34) v1(91.63,15.15) v1(91.57,14.15) v1(91.57,13.04) v1(91.57,11.86) v1(91.69,82.26) v1(91.69,81.07) v1(93.13,17.45) v1(93.13,16.34) v1(93.13,15.15) v1(93.07,14.15) v1(93.07,13.04) v1(93.07,11.86) v1(93.62,37.9) v1(93.62,36.71) v1(93.6,29.38) v1(93.6,27.87) v1(93.6,26.76) v1(93.6,25.57) v1(93.6,24.57) v1(93.6,23.46) v1(93.6,22.27) v1(93.75,40.19) v1(93.75,39) v1(94.11,53.27) v1(94.11,52.16) v1(94.11,50.97) v1(94.11,49.97) v1(94.11,48.86) v1(94.11,47.67) v1(94.25,17.46) v1(94.25,16.35) v1(94.25,15.16) v1(94.25,14.15) v1(94.25,13.04) v1(94.25,11.86) v1(95.12,37.9) v1(95.12,36.71) v1(95.1,29.38) v1(95.1,27.87) v1(95.1,26.76) v1(95.1,25.57) v1(95.1,24.57) v1(95.1,23.46) v1(95.1,22.27) v1(95.25,40.19) v1(95.25,39) v1(95.61,53.27) v1(95.61,52.16) v1(95.61,50.97) v1(95.61,49.97) v1(95.61,48.86) v1(95.61,47.67) v1(95.76,17.46) v1(95.76,16.35) v1(95.76,15.16) v1(95.76,14.15) v1(95.76,13.04) v1(95.76,11.86) v1(96.27,27.87) v1(96.27,26.76) v1(96.27,25.57) v1(96.27,24.57) v1(96.27,23.46) v1(96.27,22.27) v1(96.39,29.38) v1(96.67,92.04) v1(96.67,90.85) v1(96.73,53.28) v1(96.73,52.17) v1(96.73,50.98) v1(96.73,49.98) v1(96.73,48.87) v1(96.73,47.68) v1(96.67,37.78) v1(96.67,36.59) v1(96.79,40.06) v1(96.79,38.87) v1(97.26,17.46) v1(97.26,16.35) v1(97.26,15.16) v1(97.26,14.15) v1(97.26,13.04) v1(97.26,11.86) v1(97.77,27.87) v1(97.77,26.76) v1(97.77,25.57) v1(97.77,24.57) v1(97.77,23.46) v1(97.77,22.27) v1(97.9,29.38) v1(98.17,92.04) v1(98.17,90.85) v1(98.24,53.28) v1(98.24,52.17) v1(98.24,50.98) v1(98.24,49.98) v1(98.24,48.87) v1(98.24,47.68) v1(98.17,37.78) v1(98.17,36.59) v1(98.3,40.06) v1(98.3,38.87)
ADC1: length 16.4
  Bottom Layer w0.254: ADC1 GND.2 36.19,90.65 36.19,77.65 36.58,77.27 39.34,77.27
ADC2: length 22
  Top Layer w0.254: v1(38.61,87.94) 38.61,90.82 ADC2 GND.2 ; v1(38.74,80.31) v1(43.31,80.31)
  Bottom Layer w0.254: v1(38.74,80.31) 38.61,80.44 v1(38.61,87.94) ; v1(43.31,80.31) 43.31,74.98 43.05,74.73 41.88,74.73
BEEP: length 71.8
  Top Layer w0.254: 69.82,59.49 69.85,59.52 69.85,60.76 69.62,60.99 66.84,60.99 66.69,61.14 56.65,61.14 56.5,60.99 14.88,60.99 v1(14.73,61.14)
  Bottom Layer w0.254: 1K1.1 v1(14.73,61.14)
BIN1/DIRB: length 5
  Bottom Layer w0.254: 69.82,41.71 69.82,42.88 69.6,43.1 66.42,43.1 66.19,43.33
CE: length 37
  Top Layer w0.254: v1(77.85,55.68) 77.65,55.48 67.49,55.48 67.31,55.3 67.31,54.44 67.28,54.41 ; H4.6 95.38,63.17 v1(77.98,63.17)
  Bottom Layer w0.254: v1(77.85,55.68) 77.85,63.04 v1(77.98,63.17)
CLKR: length 32.2
  Top Layer w0.254: v1(75.36,61.14) 95.46,61.14 H4.4 ; 67.28,59.49 67.13,59.34 67.13,58.75 67.44,58.45 75.36,58.45
  Bottom Layer w0.254: v1(75.36,61.14) v1(75.36,58.45)
CSR: length 40
  Top Layer w0.254: 69.82,51.87 v1(86.49,51.87) ; v1(86.49,62.28) 98.04,62.28 98.3,62.53 98.3,63.38 H4.5
  Bottom Layer w0.254: v1(86.49,51.87) v1(86.49,62.28)
DAC1: length 40.8
  Top Layer w0.254: v1(25.02,68.12) 25.04,68.15 41.63,68.15 41.88,67.9 41.88,67.11
  Bottom Layer w0.254: v1(25.02,68.12) 24.28,68.86 DAC1 DAC2.2
DAC2: length 36
  Top Layer w0.254: v1(28.45,67.11) 39.34,67.11
  Bottom Layer w0.254: DAC1 DAC2.1 26.78,67.61 27.28,67.11 v1(28.45,67.11)
DIRA: length 80.4
  Top Layer w0.254: v1(37.72,27.74) 37.79,27.66 58.96,27.66 58.99,27.69 84.89,27.69 85.22,27.36 85.22,25.83 85.58,25.47 90.66,25.47
  Bottom Layer w0.254: 39.34,51.87 37.97,51.87 37.72,51.61 v1(37.72,27.74)
DIRB: length 77.2
  Top Layer w0.254: 41.88,46.79 42,46.66 v1(52.96,46.66) ; v1(73.53,30.13) 86.59,30.13 86.87,30.4 90.59,30.4 90.66,30.47 ; v1(52.96,24.31) 53.01,24.26 73.48,24.26 v1(73.53,24.31)
  Bottom Layer w0.254: v1(73.53,30.13) v1(73.53,24.31) ; v1(52.96,24.31) v1(52.96,46.66)
ECHO1: length 79.1
  Top Layer w0.254: v1(52.76,69.65) 41.88,69.65
  Bottom Layer w0.254: 5V TRIG1 ECHO1 GND.3 51.25,49.33 51.5,49.58 52.58,49.58 52.76,49.76 v1(52.76,69.65)
ECHO2: length 36.4
  Top Layer w0.254: 39.34,69.65 39.34,70.63 39.62,70.92 47.75,70.92 v1(47.88,70.79)
  Bottom Layer w0.254: v1(47.88,70.79) 48.75,71.66 5V TRIG2 ECHO2 GND.3
ENA: length 38.6
  Top Layer w0.254: 41.88,51.87 42,51.74 v1(53.85,51.74)
  Bottom Layer w0.254: v1(53.85,25.13) v1(53.85,51.74)
ENB: length 23.1
  Top Layer w0.254: v1(46.74,47.7) 42.56,47.7 42.43,47.83 39.78,47.83 39.34,47.39 39.34,46.79
  Bottom Layer w0.254: v1(46.74,47.7) v1(46.74,32.82)
ENCOA1: length 46.4
  Top Layer w0.254: v1(34.54,60.12) v1(12.32,60.12)
  Bottom Layer w0.254: v1(34.54,60.12) 34.59,60.17 34.59,72.75 35.31,73.46 41.66,73.46 41.88,73.24 41.88,72.19 ; PWMA1 PWMA2 ENCOA2 ENCOA1.1 9.57,60.12 v1(12.32,60.12)
ENCOA2: length 39.3
  Top Layer w0.254: v1(35.81,62.53) v1(12.45,62.53)
  Bottom Layer w0.254: v1(12.45,62.53) 9.6,62.53 PWMA1 PWMA2 ENCOA2 ENCOA1.2 ; 39.34,72.19 36.07,72.19 35.81,71.93 v1(35.81,62.53)
ENCOB1: length 58
  Top Layer w0.254: v1(5,65.08) 5,56.97 5.26,56.72 v1(33.71,56.72) ; v1(6.73,65.08) 9.53,65.08 ENCOB2 ENCOB1 PWMB2 PWMB1.2 ; v1(33.15,63.55) 33.17,63.53 41.38,63.53 41.88,64.03 41.88,64.57
  Bottom Layer w0.254: v1(33.71,56.72) 33.71,58.55 33.15,59.11 v1(33.15,63.55) ; v1(5,65.08) v1(6.73,65.08)
ENCOB2: length 55.5
  Top Layer w0.254: ENCOB2 ENCOB1 PWMB2 PWMB1.1 6.2,67.59 5.59,66.98 5.59,57.56 5.84,57.3 v1(34.29,57.3) ; v1(33.78,64.57) 39.34,64.57
  Bottom Layer w0.254: v1(34.29,57.3) 34.29,58.85 33.78,59.36 v1(33.78,64.57)
FREE_TIME10: length 34.2
  Top Layer w0.254: v1(64.13,85.14) 68.83,85.14 70.47,86.77  TIM11 TIM10.2
  Bottom Layer w0.254: 69.82,67.11 68.78,68.15 64.13,68.15 v1(64.13,85.14)
FREE_TIME11: length 31.4
  Top Layer w0.254: v1(63.37,85.9) 66.93,85.9 67.97,86.94  TIM11 TIM10.1
  Bottom Layer w0.254: v1(63.37,85.9) 63.37,67.49 63.75,67.11 67.28,67.11
IRQ: length 39.8
  Top Layer w0.254: v1(87.63,50.52) 67.46,50.52 67.28,50.34 67.28,49.33 ; v1(87.63,56.69) 98.04,56.69 98.21,56.86 H4.1
  Bottom Layer w0.254: v1(87.63,50.52) v1(87.63,56.69)
KEY1: length 47.3
  Top Layer w0.254: 69.82,69.65 v1(87.12,69.65)
  Bottom Layer w0.254: 10K5.2 88.47,90.57 SW13.2 ; 10K5.2 89.09,90.41 90.17,91.49 92.46,91.49 93.38,90.57 ; 10K5.2 89.09,86.8 100NF13.1 89.15,86.59 89.15,84.63 88.9,84.38 87.76,84.38 87.12,83.74 v1(87.12,69.65)
KEY2: length 40
  Top Layer w0.254: 67.28,69.65 67.28,70.76 67.44,70.92 v1(78.49,70.92)
  Bottom Layer w0.254: SW14.1 81.9,91.36 78.49,91.36 78.31,91.18 78.31,89.78 77.64,90.44 SW14.2 ; v1(78.49,70.92) 78.62,71.05 100NF14.1 78.62,89.47 10K8.2
KEY3: length 53.7
  Top Layer w0.254: 69.82,72.19 v1(84.84,72.19)
  Bottom Layer w0.254: v1(84.84,72.19) 84.84,97.33 85.82,98.31 SW15.2 88.04,98.31 10K7.2 ; 10K7.2 100NF16.1 ; 10K7.2 88.92,98.37 89.53,98.98 92.45,98.98 SW15.1
KEY4: length 43.5
  Top Layer w0.254: v1(73.34,74.03) 72.64,73.33 68.42,73.33 67.28,72.19
  Bottom Layer w0.254: SW16.1 81.77,99.37 78.49,99.37 78.31,99.19 78.31,97.62 10K9.2 ; 10K9.2 77.37,98.44 SW16.2 ; 10K9.2 78.38,97.42 100NF15.1 78.23,94.13 78.23,93.02 77.72,92.51 74.17,92.51 73.34,91.68 v1(73.34,74.03)
LED1: length 39.3
  Top Layer w0.254: R8.1 29.19,76.82 33.34,76.82 34.93,78.41 44.83,78.41 45.97,77.27 67.28,77.27
LED2: length 23.9
  Top Layer w0.254: v1(37.16,71.42) 31.12,71.42 30.99,71.55 30.99,73.46 30.81,73.64 29.3,73.64 R7.1
  Bottom Layer w0.254: 41.88,62.03 41.88,63.18 41.53,63.53 37.34,63.53 37.16,63.71 v1(37.16,71.42)
LED3: length 18.6
  Top Layer w0.254: R6.1 29.19,70.66 v1(36.4,70.66)
  Bottom Layer w0.254: v1(36.4,70.66) 36.4,63.35 36.67,63.08 39.12,63.08 39.34,62.86 39.34,62.03
MISOR: length 30.6
  Top Layer w0.254: v1(73.41,57.58) 92.96,57.58 93.76,58.38 H4.2 ; 69.82,62.03 73.28,62.03
  Bottom Layer w0.254: v1(73.28,62.03) 73.41,61.9 v1(73.41,57.58)
MOSIR: length 37.1
  Top Layer w0.254: v1(74.29,59.74) 97.92,59.74 98.21,60.04 H4.3 ; v1(74.29,63.53) 67.44,63.53 67.28,63.37 67.28,62.03
  Bottom Layer w0.254: v1(74.29,63.53) v1(74.29,59.74)
OLEDCLK: length 99.1
  Top Layer w0.254: OLED.3 v1(76.96,76.63) ; v1(76.96,37.82) 76.81,37.67 44.45,37.67 v1(44.32,37.54) ; v1(44.07,41.71) 41.88,41.71 42.06,41.53
  Bottom Layer w0.254: v1(44.32,37.54) 44.07,37.8 v1(44.07,41.71) ; v1(76.96,76.63) v1(76.96,37.82)
OLEDCS: length 105.2
  Top Layer w0.254: 39.34,39.17 39.34,39.77 39.8,40.23 v1(48.26,40.23) ; v1(49.02,68.63) 49.05,68.61 95.1,68.61 v1(95.12,68.63)
  Bottom Layer w0.254: v1(95.12,68.63) 95.12,86.41 95.5,86.79 OLED.7 ; v1(48.26,40.23) 48.26,67.87 v1(49.02,68.63)
OLEDDC: length 101.1
  Top Layer w0.254: v1(62.89,39.17) 41.88,39.17 ; v1(62.79,84.12) 62.84,84.18 97.71,84.18 OLED.6
  Bottom Layer w0.254: v1(62.89,39.17) 62.79,39.27 v1(62.79,84.12)
OLEDMOSI: length 95.6
  Top Layer w0.254: OLED.4 v1(75.95,79.17) ; v1(75.95,45.01) 75.95,43.1 75.59,42.75 39.52,42.75 39.34,42.56 39.34,41.71
  Bottom Layer w0.254: v1(75.95,79.17) v1(75.95,45.01)
PIN7: length 54
  Top Layer w0.254: PIN8 PIN7.1 9.31,48.64 13.41,48.64 13.59,48.82 13.59,55.3 13.72,55.42 v1(31.37,55.42) ; U1.2 35.18,74.73 33.78,73.33 v1(33.78,72.69)
  Bottom Layer w0.254: v1(33.78,72.69) 33.78,66.22 31.37,63.81 v1(31.37,55.42)
PIN8: length 57.1
  Top Layer w0.254: v1(30.78,56.14) 12.4,56.14 12.19,55.93 12.19,51.49 12.05,51.34 PIN8 PIN7.2 ; U1.21 41.93,76.02 41.78,75.87 v1(33.15,75.87)
  Bottom Layer w0.254: v1(30.78,56.14) 31.01,56.36 31.01,63.95 33.15,66.09 v1(33.15,75.87)
PWMA1: length 109.9
  Top Layer w0.254: v1(14.15,26.97) 61.98,26.97 v1(62.1,27.1) ; 69.82,36.63 69.82,35.83 69.47,35.48 v1(62.36,35.48)
  Bottom Layer w0.254: v1(62.1,27.1) 62.1,35.23 v1(62.36,35.48) ; PWMA1 PWMA2 ENCOA2 ENCOA1.4 9.67,67.47 13.97,67.47 14.15,67.29 v1(14.15,26.97)
PWMA2: length 86.8
  Top Layer w0.254: v1(62.21,65.46) 62.05,65.61 13.74,65.61 13.23,65.09 v1(12.19,65.09) ; 67.28,36.63 v1(62.23,36.63)
  Bottom Layer w0.254: v1(62.23,36.63) 62.23,65.43 v1(62.21,65.46) ; PWMA1 PWMA2 ENCOA2 ENCOA1.3 v1(12.19,65.09)
PWMB1: length 86.5
  Top Layer w0.254: v1(35.56,58.47) 6.98,58.47 6.6,58.85 6.6,59.61 7.08,60.09 ENCOB2 ENCOB1 PWMB2 PWMB1.4 ; v1(35.56,40.69) 35.58,40.67 42.52,40.67 42.67,40.82 66.69,40.82 66.84,40.67 69.49,40.67 69.85,40.31 69.85,39.2 69.82,39.17
  Bottom Layer w0.254: v1(35.56,58.47) v1(35.56,40.69)
PWMB2: length 88.4
  Top Layer w0.254: v1(50.42,38.48) 50.49,38.41 66.51,38.41 67.28,39.17 ; ENCOB2 ENCOB1 PWMB2 PWMB1.3 6.28,62.59 6.1,62.41 6.1,58.14 6.35,57.89 37.41,57.89 37.72,57.58 37.72,56.19 38.1,55.8 v1(50.29,55.8)
  Bottom Layer w0.254: v1(50.29,55.8) 50.42,55.68 v1(50.42,38.48)
SCL: length 58.5
  Top Layer w0.254: v1(25.53,19.86) v1(70.1,19.86)
  Bottom Layer w0.254: U2.3 25.4,19.74 v1(25.53,19.86) ; 69.82,29.01 70.1,28.72 v1(70.1,19.86)
SCL_FREE: length 68.8
  Top Layer w0.254: v1(86.47,49.45) 86.47,49.6 86.23,49.83 79.5,49.83 79.25,49.58 79.25,48.31 78.77,47.83 66.84,47.83 66.72,47.7 v1(57.02,47.7) ; v1(56.9,60.56) 39.42,60.56 39.37,60.5 39.37,59.52 39.34,59.49
  Bottom Layer w0.254: v1(86.47,49.45) 10K10.2 87.62,47.69 88.01,47.3 90.3,47.3 3.3 GND SCL SDA.3 ; v1(57.02,47.7) 57.02,60.43 v1(56.9,60.56)
SDA: length 58
  Top Layer w0.254: v1(67.31,20.75) 67.06,20.5 v1(22.99,20.5)
  Bottom Layer w0.254: U2.4 22.86,20.37 v1(22.99,20.5) ; v1(67.31,20.75) 67.31,28.97 67.28,29.01
SDA_FREE: length 66.7
  Top Layer w0.254: v1(86.49,42.72) 79.25,42.72 78.74,43.23 78.74,45.39 78.38,45.75 56.26,45.75 v1(56.13,45.87) ; 41.88,59.49 v1(56.13,59.49)
  Bottom Layer w0.254: v1(56.13,59.49) v1(56.13,45.87) ; v1(86.49,42.72) 86.49,44.36 10K11.2 87.5,44.37 88.07,44.94 3.3 GND SCL SDA.4
STEER1: length 19.3
  Bottom Layer w0.254: STER1 STER2 .2 67.97,81.35 67.56,80.95 66.42,80.95 65.66,80.19 65.66,75.11 66.1,74.66 67.21,74.66 67.28,74.73
STEER2: length 13.9
  Bottom Layer w0.254: STER1 STER2 .1 70.47,86.77 69.82,86.12 69.82,77.27
STEPA: length 86.6
  Top Layer w0.254: v1(55.25,22.96) 90.53,22.96 DIRB STEPB DIRA STEPA.1 ; 39.34,56.95 39.34,57.04 40.26,57.96 41.42,57.96 41.44,57.99 55.09,57.99 v1(55.12,57.96)
  Bottom Layer w0.254: v1(55.25,22.96) 55.12,23.09 v1(55.12,57.96)
STEPB: length 31.5
  Top Layer w0.254: U1.58 67.33,34.89 67.56,35.13 85.45,35.13 v1(85.47,35.1) ; v1(85.5,27.9) 85.53,27.86 90.55,27.86 90.66,27.97
  Bottom Layer w0.254: v1(85.47,35.1) 85.5,35.07 v1(85.5,27.9)
TRIG1: length 54.3
  Top Layer w0.254: 41.88,49.33 42.13,49.07 v1(49.28,49.07)
  Bottom Layer w0.254: 5V TRIG1 ECHO1 GND.2 48.75,10.8 48.53,11.02 48.53,39.68 49.28,40.42 v1(49.28,49.07)
TRIG2: length 59.5
  Top Layer w0.254: 39.34,49.33 39.34,50.18 39.52,50.37 51.08,50.37 v1(51.18,50.47)
  Bottom Layer w0.254: 5V TRIG2 ECHO2 GND.2 51.25,50.54 v1(51.18,50.47)
USART1RX: length 95.7
  Top Layer w0.254: v1(64.19,26.34) 64.09,26.25 GND 5V RX1 TX1.3
  Bottom Layer w0.254: 67.28,64.57 64.39,64.57 64.19,64.36 v1(64.19,26.34)
USART1TX: length 103.3
  Top Layer w0.254: v1(63.63,23.67) 63.5,23.55 13.46,23.55 12.76,24.25 GND 5V RX1 TX1.4
  Bottom Layer w0.254: v1(63.63,23.67) 63.6,23.7 63.6,65.18 64.13,65.71 69.72,65.71 69.82,65.62 69.82,64.57
USART2RX: length 49.5
  Bottom Layer w0.254: 67.28,56.95 66.17,56.95 65.61,56.39 65.61,18.9 67.82,16.68 TX2 RX2 GND.2
USART2TX: length 49.1
  Bottom Layer w0.254: 69.82,56.95 71.12,56.95 71.37,56.69 71.37,17.58 70.32,16.53 TX2 RX2 GND.1
USART3RX: length 48.9
  Top Layer w0.254: 41.88,36.63 42,36.75 42,37.68 41.78,37.9 v1(35.66,37.9) ; v1(14.22,22.4) v1(35.69,22.4)
  Bottom Layer w0.254: v1(14.22,22.4) 9.95,22.4 5V GND TX3 RX3.1 ; v1(35.69,22.4) 35.69,37.87 v1(35.66,37.9)
USART3TX: length 41.1
  Top Layer w0.254: v1(14.22,24.96) 35.09,24.96 v1(35.1,24.94) ; v1(35.1,36.63) 39.34,36.63
  Bottom Layer w0.254: v1(35.1,24.94) v1(35.1,36.63) ; 9.9,24.96 v1(14.22,24.96)
USART4RX: length 39.6
  Top Layer w0.254: v1(65.28,15.04) 65.3,15.02 TX4 RX4 GND.2 ; v1(64.77,46.66) 67.15,46.66 67.28,46.79
  Bottom Layer w0.254: v1(64.77,46.66) 64.77,17.58 65.28,17.07 v1(65.28,15.04)
USART4TX: length 49.4
  Top Layer w0.254: TX4 RX4 GND.1 62.8,15.86 63.12,16.18 72.52,16.18 v1(72.64,16.31) ; v1(72.64,46.79) 69.82,46.79
  Bottom Layer w0.254: v1(72.64,16.31) v1(72.64,46.79)
WT1RX: length 63.7
  Top Layer w0.254: 67.28,51.87 67.28,52.66 67.06,52.88 v1(45.85,52.88)
  Bottom Layer w0.254: 串口陀螺仪1.4 44.58,21.39 45.85,22.66 v1(45.85,52.88)
WT1TX: length 63.7
  Top Layer w0.254: 69.82,49.33 68.78,48.29 43.46,48.29 v1(43.43,48.31)
  Bottom Layer w0.254: v1(43.43,48.31) 43.43,23.04 42.04,21.64 串口陀螺仪1.3
$1N1394: length 3.7
  Bottom Layer w0.254: TX2 RX2 GND.4 62.93,9.81 C4.1
$1N1400: length 3.7
  Top Layer w0.254: C5.1 70.36,12.75 70.36,9.88 TX4 RX4 GND.4
$1N3379: length 9.1
  Bottom Layer w0.762: 10K12.1 1K1.2 14.61,78.39 14.61,80.7 13.64,81.66 Q1.1
$1N3380: length 10.7
  Bottom Layer w0.762: Q1.3 9.8,75.38 9.4,74.98 4.61,74.98 BUZZER1.2
$1N4295: length 1.9
  Top Layer w0.254: LED3.2 27.24,83.65 R2.2
$1N4297: length 1.9
  Top Layer w0.254: R3.2 LED4.2
$1N4301: length 2.4
  Top Layer w0.254: LED5.2 26.94,70.92 R6.2
$1N4304: length 2.4
  Top Layer w0.254: LED6.2 24.99,73.8 R7.2
$1N4307: length 2.3
  Top Layer w0.254: LED7.2 27,77.01 R8.2

## Copper pours and planes (outline as drawn; the poured copper is in the pictures)
+3.3V on Top Layer: 57.02,30.28 60.2,30.28 60.2,27.99 57.02,27.99
GND on Top Layer: -114.05,122.99 -0.38,122.99 -0.38,18.34 -114.05,18.34
GND on Bottom Layer: -138.56,128.83 -17.78,128.83 -17.78,0.69 -138.56,0.69

Small or netless copper shapes (teardrops, artwork), in the pictures only: 202 on Top Layer, 209 on Bottom Layer
